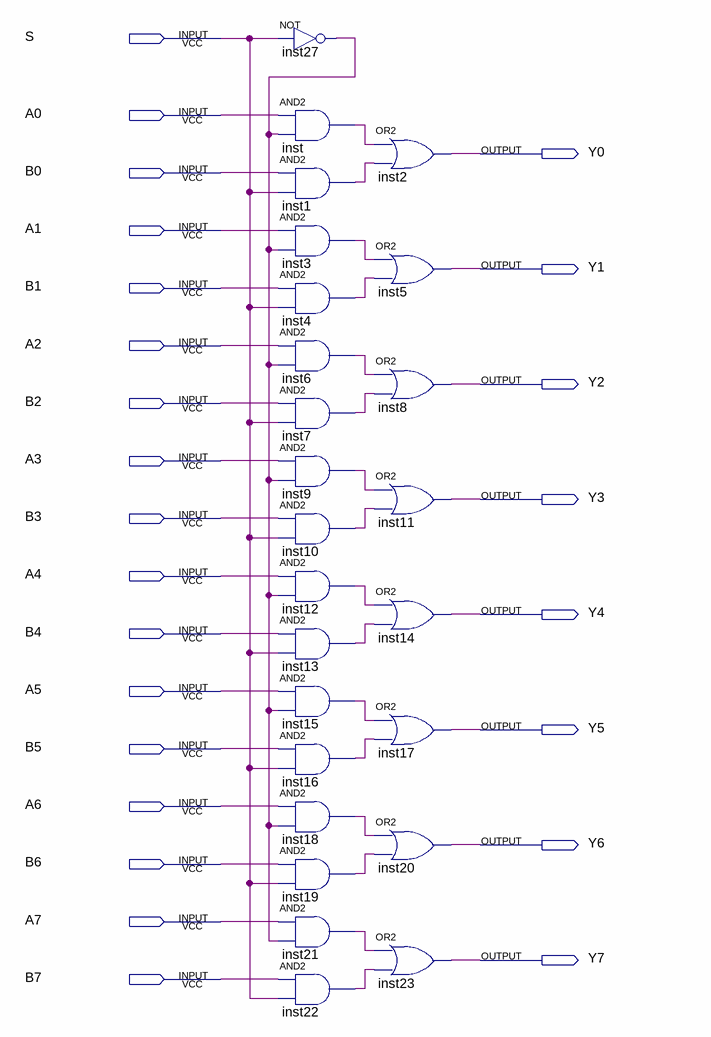
[diagram p0: schematic sheet]
// Quartus schematic MS16X8.bdf as structural Verilog: 25 symbols, 25 pins
module MS16X8 (
  input  S,
  input  A0,
  input  B0,
  input  A1,
  input  B1,
  input  A2,
  input  B2,
  input  A3,
  input  B3,
  input  A4,
  input  B4,
  input  A5,
  input  B5,
  input  A6,
  input  B6,
  input  A7,
  input  B7,
  output Y0,
  output Y1,
  output Y2,
  output Y3,
  output Y4,
  output Y5,
  output Y6,
  output Y7
);

  wire inst1_out, inst3_out, inst4_out, inst6_out, inst7_out, inst9_out, inst10_out, inst12_out, inst13_out,
       inst15_out, inst16_out, inst18_out, inst19_out, inst21_out, inst22_out, inst27_out, inst_out;

  not inst27 (inst27_out, S);
  and inst (inst_out, A0, inst27_out);
  and inst1 (inst1_out, B0, S);
  and inst3 (inst3_out, A1, inst27_out);
  and inst4 (inst4_out, B1, S);
  and inst6 (inst6_out, A2, inst27_out);
  and inst7 (inst7_out, B2, S);
  and inst9 (inst9_out, A3, inst27_out);
  and inst10 (inst10_out, B3, S);
  and inst12 (inst12_out, A4, inst27_out);
  and inst13 (inst13_out, B4, S);
  and inst15 (inst15_out, A5, inst27_out);
  and inst16 (inst16_out, B5, S);
  and inst18 (inst18_out, A6, inst27_out);
  and inst19 (inst19_out, B6, S);
  and inst21 (inst21_out, A7, inst27_out);
  and inst22 (inst22_out, B7, S);
  or inst2 (Y0, inst_out, inst1_out);
  or inst5 (Y1, inst3_out, inst4_out);
  or inst8 (Y2, inst6_out, inst7_out);
  or inst11 (Y3, inst9_out, inst10_out);
  or inst14 (Y4, inst12_out, inst13_out);
  or inst17 (Y5, inst15_out, inst16_out);
  or inst20 (Y6, inst18_out, inst19_out);
  or inst23 (Y7, inst21_out, inst22_out);
endmodule
